# EAGLE design proximity_switch_connector_1p1 (EAGLE 9.4.2)
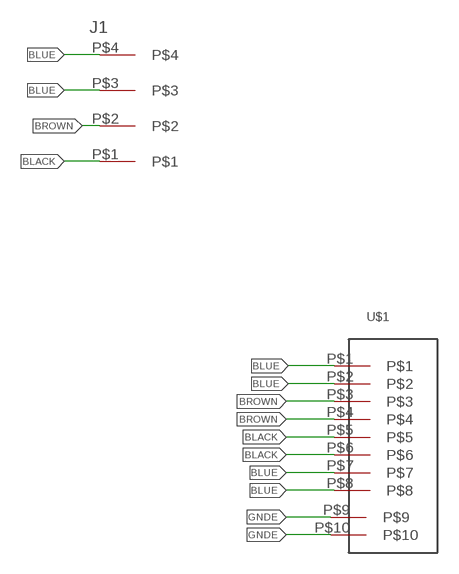
[diagram p0: schematic, sheet 1]

## Parts
J1  3.81MM_1_X_4_RT_ANGLE_PLUG_HEADER  [1X4_3.81MM_PITCH]
U$1  RJ45_SMTRJ  [RJ45_SMT]

## Nets
BLACK: J1.P$1 U$1.P$5 U$1.P$6
BLUE: J1.P$3 J1.P$4 U$1.P$1 U$1.P$2 U$1.P$7 U$1.P$8
BROWN: J1.P$2 U$1.P$3 U$1.P$4
GNDE: U$1.P$9 U$1.P$10

## Library data of the parts
J1 = 3D_MIG_Controller:3.81MM_1_X_4_RT_ANGLE_PLUG_HEADER
U$1 = 3D_MIG_Controller:RJ45_SMT

## Board
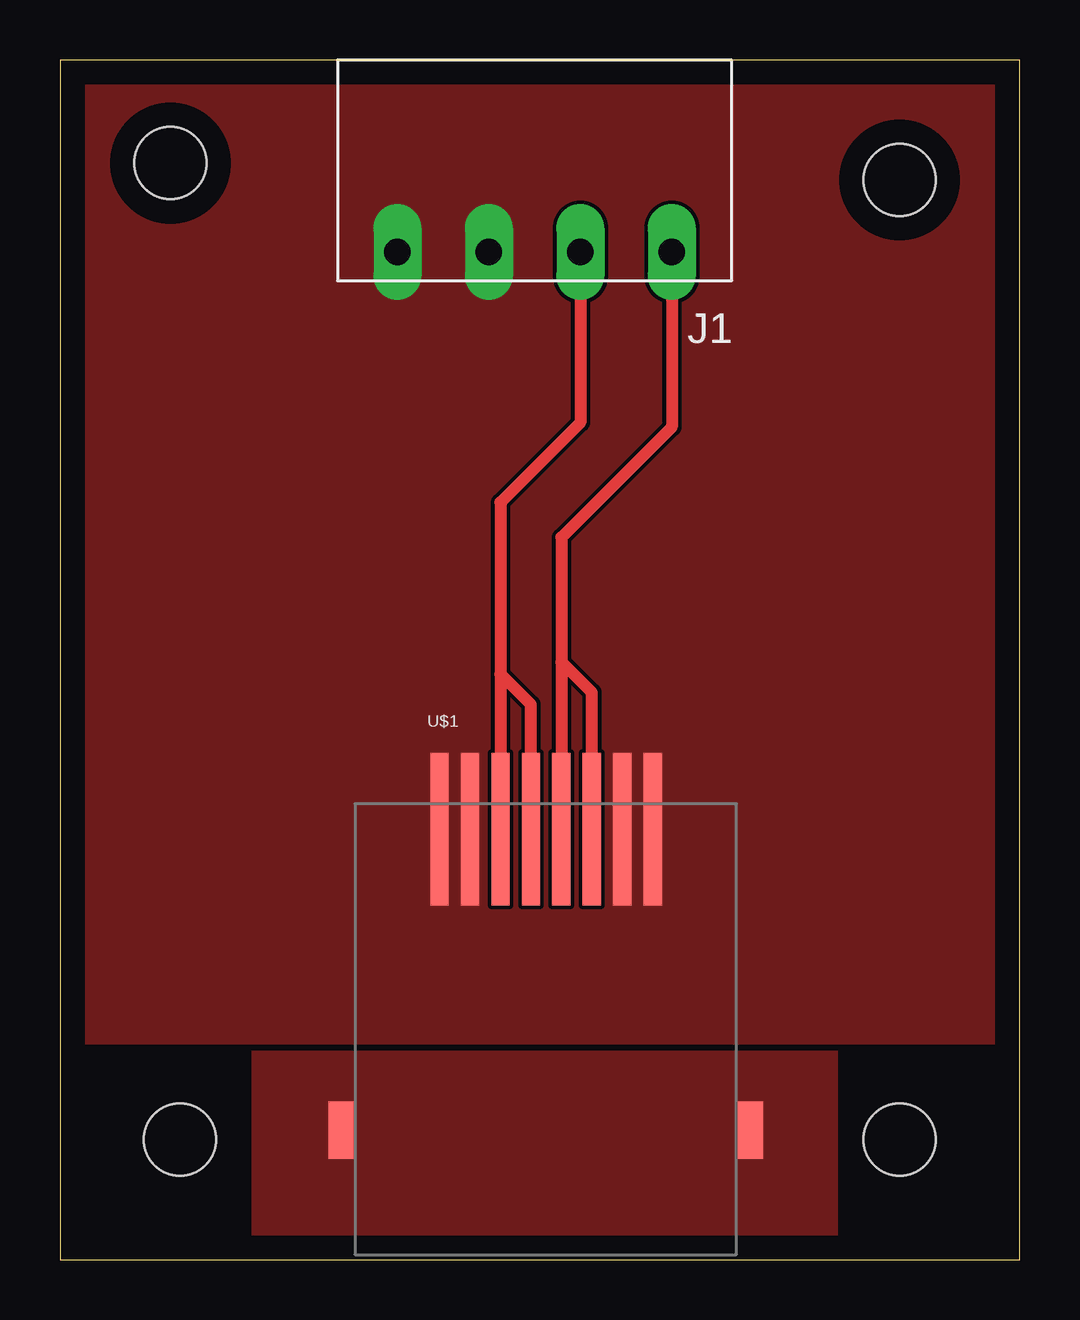
[diagram p1: board, top side]
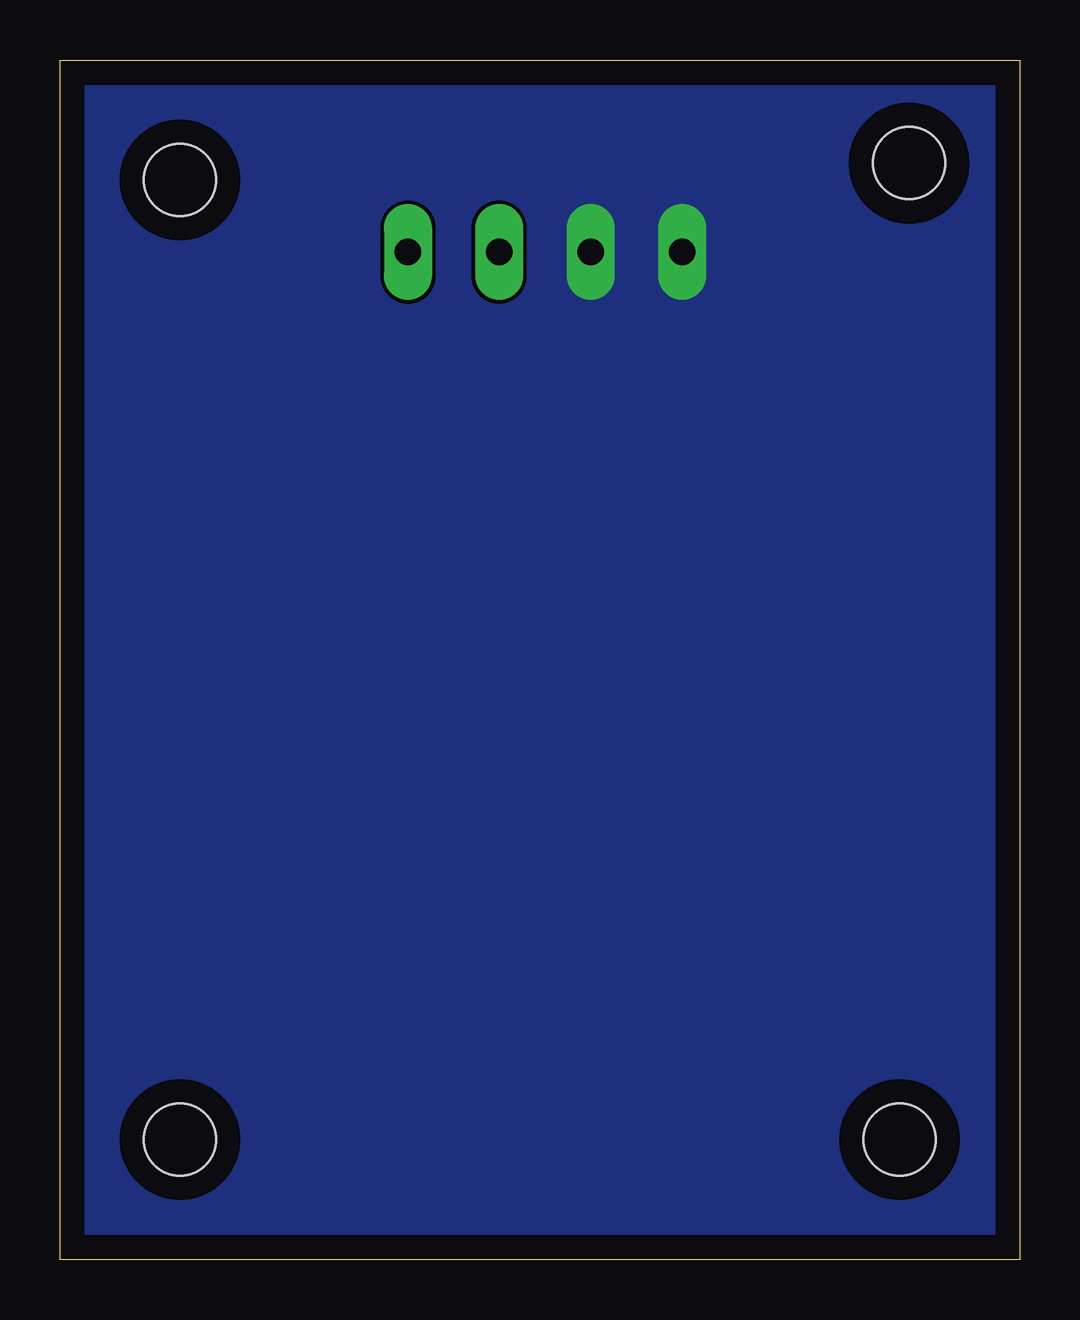
[diagram p2: board, bottom side, seen from below]

Size 40 x 50 mm. Coordinates in mm from the lower left corner, seen from the top.
Outline: 0,0 40,0 40,50 0,50 0,0
Copper layers (1*16): Top 0.035mm / dielectric 1.5mm / Bottom 0.035mm
Design rules "default": minimum track width 6mil, minimum drill 0.35mm, track to track 6mil, track to pad 6mil, pad to pad 6mil, via to via 6mil, smd to smd 6mil, copper to edge 40mil, drill to drill 6mil, minimum pad ring 10mil, minimum via ring 8mil, stop-mask expansion 4mil, vias tented up to drill 0mil, thermal gap 10mil
Holes 3 mm at 4.6,45.7 35,45 5,5 35,5

### Footprints (pad centres in the part's own frame; a part is rotated, then mirrored left to right if it is on the bottom)
1X4_3.81MM_PITCH = drill 1.1 pad 2 long: P$1 0,0; P$2 3.81,0; P$3 7.62,0; P$4 11.43,0
RJ45_SMT = smd 0.76 x 6.35: P$1 -3.18,8.94; P$2 -1.91,8.94; P$3 -0.64,8.94; P$4 0.63,8.94; P$5 1.9,8.94; P$6 3.17,8.94; P$7 4.44,8.94; P$8 5.71,8.94 | smd 1.1 x 2.4: P$9 -7.25,-3.6; P$10 9.75,-3.6

### Placement (x,y rotation side)
J1  25.5,42 180 top
U$1  19,9 0 top

### Tracks (layer width: path | path; a pad name or v marks a point on that pad's centre or on a via)
BLACK
  Top 0.508: J1.P$1 25.5,34.7 20.9,30.1 20.9,24.9 | 20.9,24.9 U$1.P$5 | U$1.P$6 22.17,23.63 20.9,24.9
BLUE
  pour Top (no thermals): 0,50 0,9 40,9 40,50
  pour Bottom (no thermals): 0,0 40,0 40,50 0,50
BROWN
  Top 0.508: J1.P$2 21.69,34.89 18.36,31.56 18.36,24.4 | 18.36,24.4 U$1.P$3 | U$1.P$4 19.63,23.13 18.36,24.4
GNDE
  pour Top (no thermals): 8,0 8,8.7 32.4,8.7 32.4,0